# Altium schematic sheet BBB_Connection.SchDoc
size A3; Author: Sofian Jafar; Engineer: Sofian Jafar; DocumentNumber: 3; Revision: 1.0; SheetNumber: 3; SheetTotal: 3; Descripition: UltraSound BBB Cape; SheetDescription: Connectors and HV Power Supply
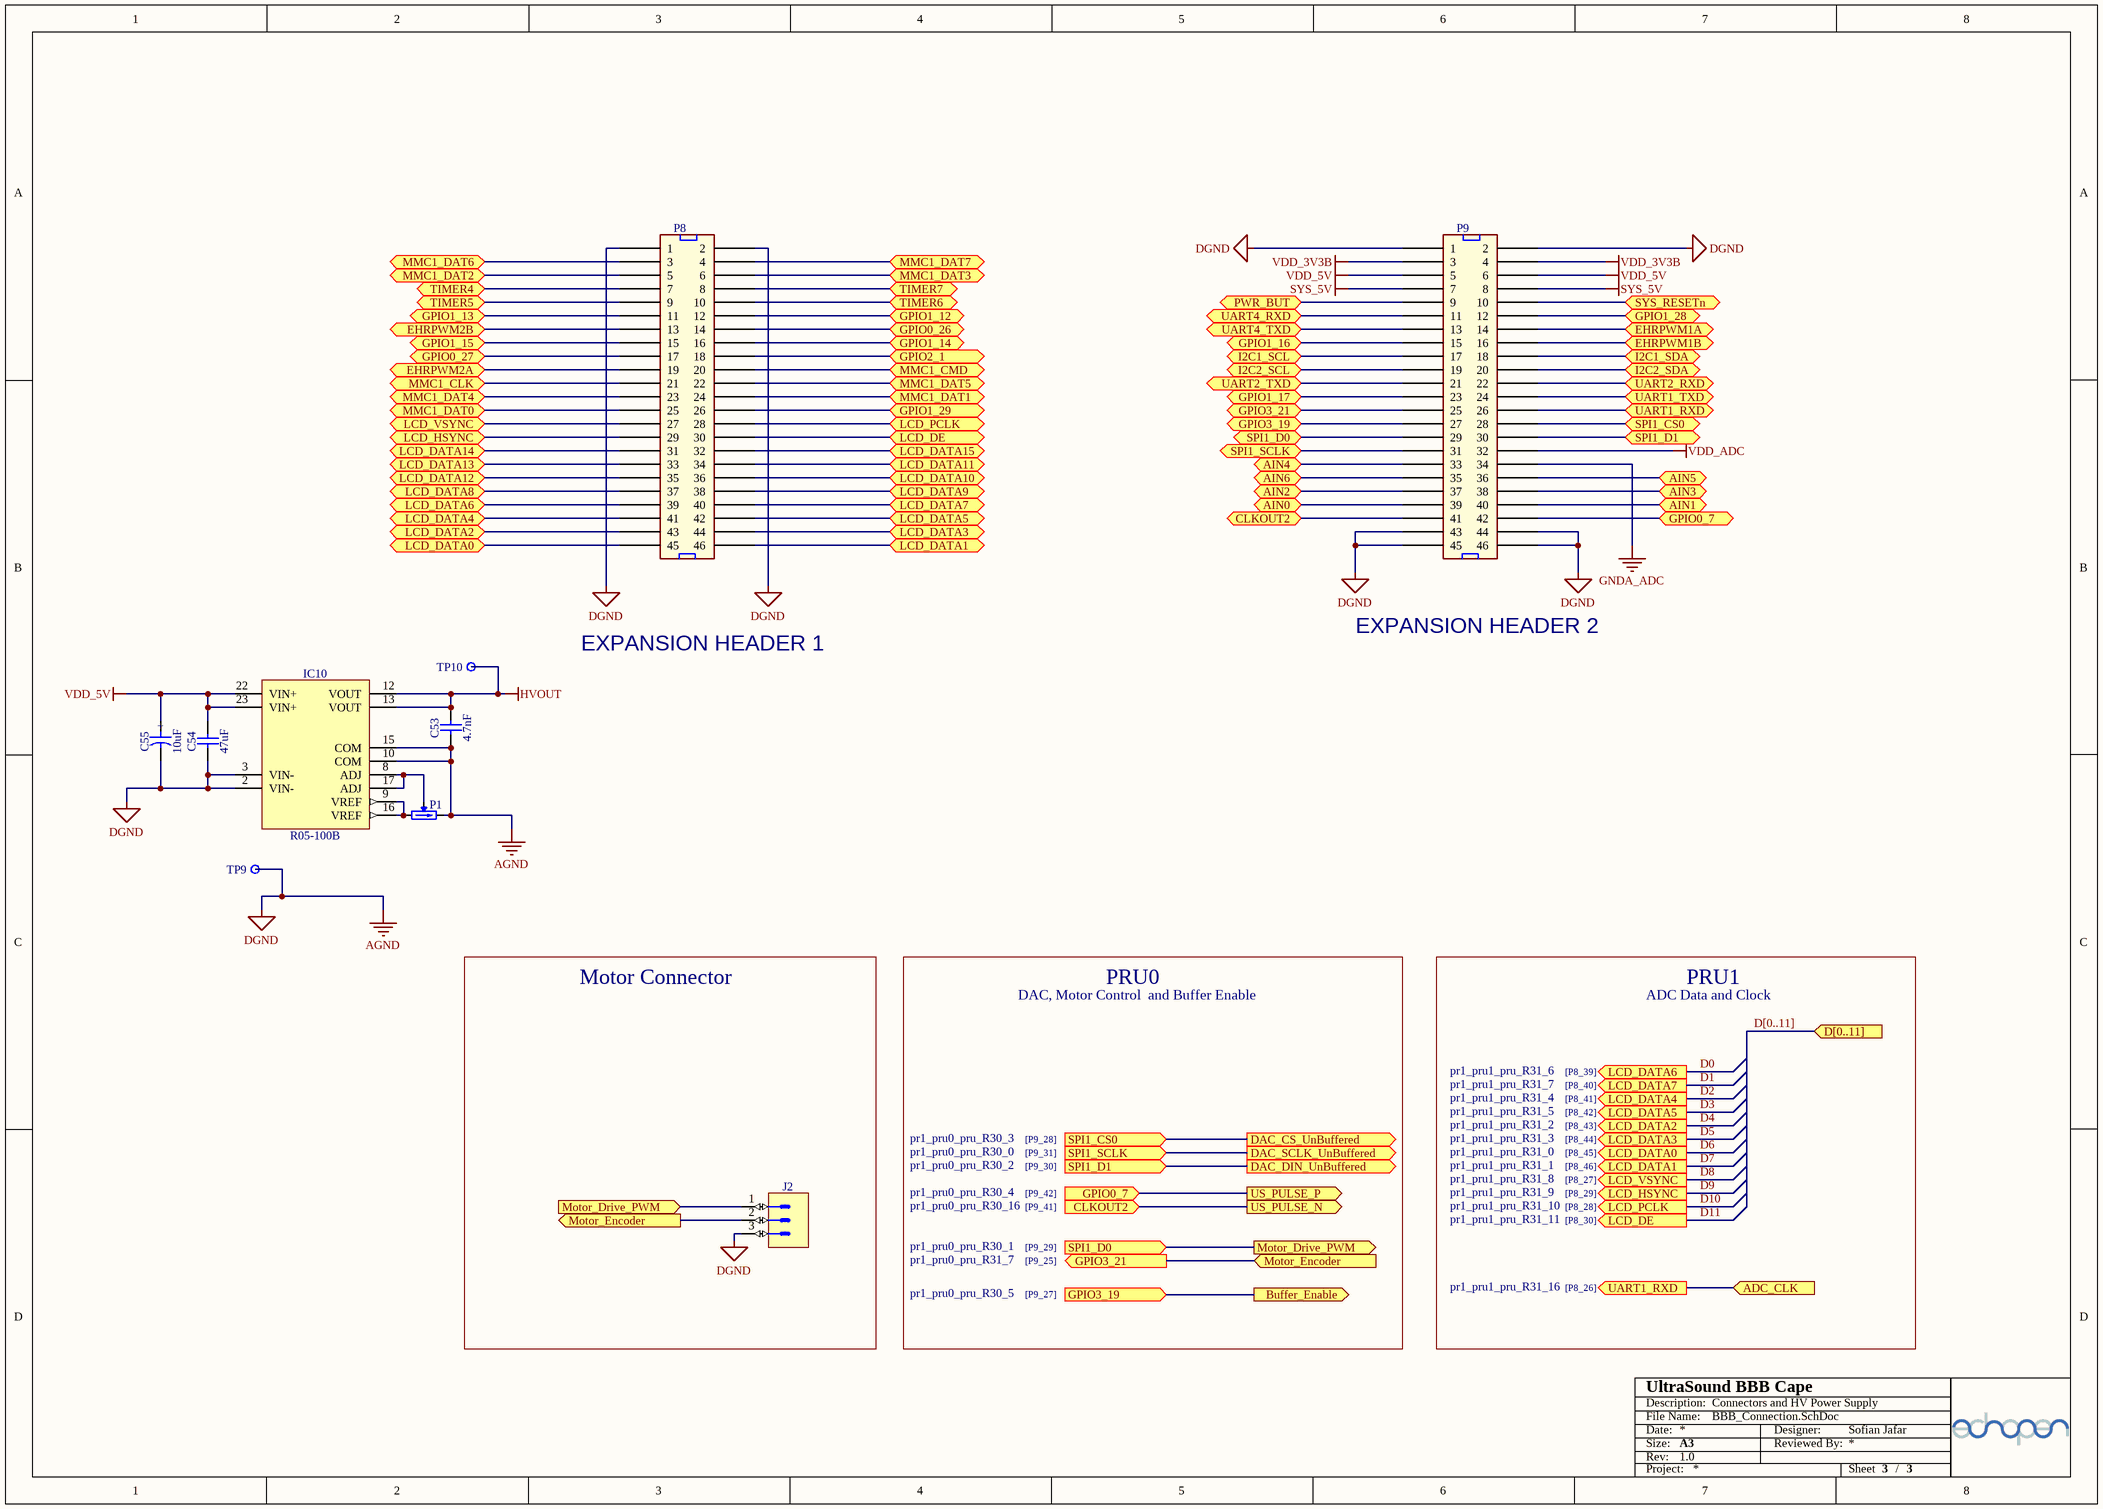
[diagram p0: BBB_Connection.SchDoc]

## Parts
C53  4.7nF  [CAPC2012X110N]
C54  47uF  [CAPC3216X180N]
C55  10uF  [CAPMP3528X210N]
IC10  R05-100B  [PWS_RECOM_R05-100B]
J2  (no value)  [PHOENIX_1803439]
P1  5k  [TRIM_BOURNS_3223W]  (value not drawn)
P8  (no value)  [SAMTEC_TSW-123-07-L-D-LL]
P9  (no value)  [SAMTEC_TSW-123-07-L-D-LL]
TP9  Test Point  [NICOMATIC_C12000B]  (value not drawn)
TP10  Test Point  [NICOMATIC_C12000B]  (value not drawn)

## Blocks framed on the sheet
Motor Connector: J2

## Ports
ADC_CLK (in), AIN0, AIN1, AIN2, AIN3, AIN4, AIN5, AIN6, Buffer_Enable (out), CLKOUT2, CLKOUT2 (in), D[0..11] (in), DAC_CS_UnBuffered (out), DAC_DIN_UnBuffered (out), DAC_SCLK_UnBuffered (out), EHRPWM1A, EHRPWM1B, EHRPWM2A, EHRPWM2B, GPIO0_7, GPIO0_7 (in), GPIO0_26, GPIO0_27, GPIO1_12, GPIO1_13, GPIO1_14, GPIO1_15, GPIO1_16, GPIO1_17, GPIO1_28, GPIO1_29, GPIO2_1, GPIO3_19, GPIO3_19 (in), GPIO3_21, GPIO3_21 (out), I2C1_SCL, I2C1_SDA, I2C2_SCL, I2C2_SDA, LCD_DATA0, LCD_DATA0 (out), LCD_DATA1, LCD_DATA1 (out), LCD_DATA2, LCD_DATA2 (out), LCD_DATA3, LCD_DATA3 (out), LCD_DATA4, LCD_DATA4 (out), LCD_DATA5, LCD_DATA5 (out), LCD_DATA6, LCD_DATA6 (out), LCD_DATA7, LCD_DATA7 (out), LCD_DATA8, LCD_DATA9, LCD_DATA10, LCD_DATA11, LCD_DATA12, LCD_DATA13, LCD_DATA14, LCD_DATA15, LCD_DE, LCD_DE (out), LCD_HSYNC, LCD_HSYNC (out), LCD_PCLK, LCD_PCLK (out), LCD_VSYNC, LCD_VSYNC (out), MMC1_CLK, MMC1_CMD, MMC1_DAT0, MMC1_DAT1, MMC1_DAT2, MMC1_DAT3, MMC1_DAT4, MMC1_DAT5, MMC1_DAT6, MMC1_DAT7, Motor_Drive_PWM (in), Motor_Drive_PWM (out), Motor_Encoder (in), Motor_Encoder (out), PWR_BUT, SPI1_CS0, SPI1_CS0 (in), SPI1_D0, SPI1_D0 (in), SPI1_D1, SPI1_D1 (in), SPI1_SCLK, SPI1_SCLK (in), SYS_RESETn, TIMER4, TIMER5, TIMER6, TIMER7, UART1_RXD, UART1_RXD (out), UART1_TXD, UART2_RXD, UART2_TXD, UART4_RXD, UART4_TXD, US_PULSE_N (out), US_PULSE_P (out)

## Nets
AGND: C53.1 C54.1 C55.2 IC10.2(VIN-) IC10.3(VIN-) IC10.10(COM) IC10.15(COM) J2.3 P1.3(CW) P8.1 P8.2 P9.1 P9.2 P9.43 P9.44 P9.45 P9.46 TP9.1  [also labelled DGND]
GNDA_ADC: P9.34
HVOUT: C53.2 IC10.12(VOUT) IC10.13(VOUT) TP10.1
SYS_5V: P9.7 P9.8
VDD_3V3B: P9.3 P9.4
VDD_5V: C54.2 C55.1 IC10.22(VIN+) IC10.23(VIN+) P9.5 P9.6
VDD_ADC: P9.32
ADC_CLK: P9.26 ; port UART1_RXD, port ADC_CLK
AIN0: P9.39 ; port AIN0
AIN1: P9.40 ; port AIN1
AIN2: P9.37 ; port AIN2
AIN3: P9.38 ; port AIN3
AIN4: P9.33 ; port AIN4
AIN5: P9.36 ; port AIN5
AIN6: P9.35 ; port AIN6
Buffer_Enable: P9.27 ; port GPIO3_19, port Buffer_Enable
CLKOUT2: P9.41 ; port CLKOUT2, port US_PULSE_N
D0: P8.39 ; port LCD_DATA6
D1: P8.40 ; port LCD_DATA7
D2: P8.41 ; port LCD_DATA4
D3: P8.42 ; port LCD_DATA5
D4: P8.43 ; port LCD_DATA2
D5: P8.44 ; port LCD_DATA3
D6: P8.45 ; port LCD_DATA0
D7: P8.46 ; port LCD_DATA1
D8: P8.27 ; port LCD_VSYNC
D9: P8.29 ; port LCD_HSYNC
D10: P8.28 ; port LCD_PCLK
D11: P8.30 ; port LCD_DE
DAC_CS_UnBuffered: P9.28 ; port SPI1_CS0, port DAC_CS_UnBuffered
DAC_DIN_UnBuffered: P9.30 ; port SPI1_D1, port DAC_DIN_UnBuffered
DAC_SCLK_UnBuffered: P9.31 ; port SPI1_SCLK, port DAC_SCLK_UnBuffered
EHRPWM1A: P9.14 ; port EHRPWM1A
EHRPWM1B: P9.16 ; port EHRPWM1B
EHRPWM2A: P8.19 ; port EHRPWM2A
EHRPWM2B: P8.13 ; port EHRPWM2B
GPIO0_7: P9.42 ; port GPIO0_7, port US_PULSE_P
GPIO0_26: P8.14 ; port GPIO0_26
GPIO0_27: P8.17 ; port GPIO0_27
GPIO1_12: P8.12 ; port GPIO1_12
GPIO1_13: P8.11 ; port GPIO1_13
GPIO1_14: P8.16 ; port GPIO1_14
GPIO1_15: P8.15 ; port GPIO1_15
GPIO1_16: P9.15 ; port GPIO1_16
GPIO1_17: P9.23 ; port GPIO1_17
GPIO1_28: P9.12 ; port GPIO1_28
GPIO1_29: P8.26 ; port GPIO1_29
GPIO2_1: P8.18 ; port GPIO2_1
GPIO3_21: J2.2 P9.25 ; port GPIO3_21, port Motor_Encoder
I2C1_SCL: P9.17 ; port I2C1_SCL
I2C1_SDA: P9.18 ; port I2C1_SDA
I2C2_SCL: P9.19 ; port I2C2_SCL
I2C2_SDA: P9.20 ; port I2C2_SDA
LCD_DATA8: P8.37 ; port LCD_DATA8
LCD_DATA9: P8.38 ; port LCD_DATA9
LCD_DATA10: P8.36 ; port LCD_DATA10
LCD_DATA11: P8.34 ; port LCD_DATA11
LCD_DATA12: P8.35 ; port LCD_DATA12
LCD_DATA13: P8.33 ; port LCD_DATA13
LCD_DATA14: P8.31 ; port LCD_DATA14
LCD_DATA15: P8.32 ; port LCD_DATA15
MMC1_CLK: P8.21 ; port MMC1_CLK
MMC1_CMD: P8.20 ; port MMC1_CMD
MMC1_DAT0: P8.25 ; port MMC1_DAT0
MMC1_DAT1: P8.24 ; port MMC1_DAT1
MMC1_DAT2: P8.5 ; port MMC1_DAT2
MMC1_DAT3: P8.6 ; port MMC1_DAT3
MMC1_DAT4: P8.23 ; port MMC1_DAT4
MMC1_DAT5: P8.22 ; port MMC1_DAT5
MMC1_DAT6: P8.3 ; port MMC1_DAT6
MMC1_DAT7: P8.4 ; port MMC1_DAT7
Motor_Drive_PWM: J2.1 P9.29 ; port SPI1_D0, port Motor_Drive_PWM
PWR_BUT: P9.9 ; port PWR_BUT
SYS_RESETn: P9.10 ; port SYS_RESETn
TIMER4: P8.7 ; port TIMER4
TIMER5: P8.9 ; port TIMER5
TIMER6: P8.10 ; port TIMER6
TIMER7: P8.8 ; port TIMER7
UART1_TXD: P9.24 ; port UART1_TXD
UART2_RXD: P9.22 ; port UART2_RXD
UART2_TXD: P9.21 ; port UART2_TXD
UART4_RXD: P9.11 ; port UART4_RXD
UART4_TXD: P9.13 ; port UART4_TXD
NetIC10_8: IC10.8(ADJ) IC10.17(ADJ) P1.2(W)
NetIC10_9: IC10.9(VREF) IC10.16(VREF) P1.1(CCW)

## Buses and harness runs
bus D[0..11] = port D[0..11]

## Notes on the sheet
- EXPANSION HEADER 1
- EXPANSION HEADER 2
- PRU0
- PRU1
- DAC, Motor Control  and Buffer Enable
- ADC Data and Clock
- pr1_pru1_pru_R31_2
- pr1_pru1_pru_R31_4
- pr1_pru1_pru_R31_5
- pr1_pru1_pru_R31_6
- pr1_pru1_pru_R31_7
- [P8_39]
- [P8_40]
- [P8_43]
- [P8_41]
- [P8_42]
- pr1_pru0_pru_R30_3
- pr1_pru0_pru_R30_0
- pr1_pru0_pru_R30_2
- [P9_28]
- [P9_31]
- [P9_30]
- pr1_pru1_pru_R31_0
- pr1_pru1_pru_R31_1
- pr1_pru1_pru_R31_3
- pr1_pru1_pru_R31_8
- [P8_27]
- [P8_45]
- [P8_46]
- [P8_44]
- pr1_pru0_pru_R30_1
- pr1_pru0_pru_R31_7
- pr1_pru0_pru_R30_16
- pr1_pru0_pru_R30_4
- [P9_29]
- [P9_25]
- [P9_41]
- [P9_42]
- pr1_pru1_pru_R31_9
- pr1_pru1_pru_R31_10
- pr1_pru1_pru_R31_11
- [P8_28]
- [P8_29]
- [P8_30]
- pr1_pru0_pru_R30_5
- [P9_27]
- pr1_pru1_pru_R31_16
- [P8_26]
- File Name:
- Date:
- Rev:
- Description:
- Size:
- A3
- Designer:
- Reviewed By:
- Project:
- Sheet
- /
- (in symbol CTE3528-21_10UF_16V_10%_LESR0800) +

## Library data of the parts
C53 = CC0805_4.7NF_250V_10%_X7R: Non-polarised capacitor; Part Description: SMD Multilayer Chip Ceramic Capacitor; Manufacturer: GENERIC; Manufacturer1 Part Number: GRM21AR72E472KW01D; Voltage: 250V; TC: X7R; Tolerance: ±10%; Table: Capacitors SMD; Part Number: CC0805_4.7NF_250V_10%_X7R; Component Kind: Standard; Component Type: Standard; Pin Count: 2; Value: 4.7nF; Status: Preferred; Manufacturer Part Number: CC0805_4.7NF_250V_10%_X7R; Case: 0805; Mounted: Yes; Socket: No; SMD: Yes; Manufacturer1 Example: MURATE; Manufacturer1 ComponentHeight: 1.1mm; Author: S. Jafar; CreateDate: 12/21/2015; LatestRevisionDate: 1/10/2016
C54 = CC1206_47UF_25V_20%_X5R: Non-polarised capacitor; Part Description: SMD Multilayer Chip Ceramic Capacitor; Manufacturer: TDK; Manufacturer Part Number: C3216X5R1E476M160AC; Voltage: 25V; TC: X5R; Tolerance: ±20%; Table: Capacitors SMD; Part Number: CC1206_47UF_25V_20%_X5R; Component Kind: Standard; Component Type: Standard; Pin Count: 2; Value: 47uF; Status: None; Case: 1206; Mounted: Yes; Socket: No; SMD: Yes; ComponentHeight: 1.8mm; HelpURL: \\cern.ch\dfs\Applications\Altium\Datasheets\CC1206_X5R_TDK_C.pdf; Author: CERN DEM JLC; CreateDate: 11/20/2013; LatestRevisionDate: 11/20/2013
C55 = CTE3528-21_10UF_16V_10%_LESR0800: Polarised capacitor; Part Description: Low ESR 0R8 Solid Tantalum Chip Capacitor; Manufacturer: GENERIC; Manufacturer1 Part Number: TPSB106K016R0800; Voltage: 16V; Tolerance: ±10%; Table: Capacitors SMD; Part Number: CTE3528-21_10UF_16V_10%_LESR0800; Component Kind: Standard; Component Type: Standard; Pin Count: 2; Value: 10uF; Status: Preferred; Manufacturer Part Number: CTE3528-21_10UF_16V_10%_LESR0800; Case: B; Mounted: Yes; Socket: No; SMD: Yes; Manufacturer1 Example: AVX; Manufacturer1 ComponentHeight: 2.1mm; HelpURL: \\cern.ch\dfs\Applications\Altium\Datasheets\CTE-LESR_AVX_TPS.pdf; Author: CERN DEM JLC; CreateDate: 5/5/2008; LatestRevisionDate: 1/20/2009
IC10 = R05-100B: Power Supply; Part Description: +5VDC to +55-135VDC 5W Power Supply; Manufacturer: RECOM POWER; Table: Power Supplies; Part Number: R05-100B; Component Kind: Standard; Component Type: Standard; Device: R05-100B; PackageDescription: 55-135V 5W Power Supply, Body 32x21mm; Status: None; Manufacturer Part Number: R05-100B; Pin Count: 12; Mounted: Yes; Socket: No; SMD: No; ComponentHeight: 9.4mm; Author: S. Jafar; CreateDate: 12/21/2015; LatestRevisionDate: 12/21/2015
J2 = PHOENIX_1803439: Connector 3 Male; Part Description: 8A 160 V, Pitch: 3.81mm, 3 Positions Header; Manufacturer: PHOENIX CONTACT; Manufacturer Part Number: 1803439 (MCV 1,5/3-G-3,81); Part Number: PHOENIX_1803439; Component Kind: Standard; Component Type: Standard; Pin Count: 3; Mounted: Yes; Socket: No; SMD: No; Status: None; ComponentHeight: 9.2mm; HelpURL: \\cern.ch\dfs\Applications\Altium\Datasheets\PHOENIX_1803439.pdf; Author: CERN DEM JLC; CreateDate: 5/4/2010; LatestRevisionDate: 5/4/2010; Table: PHOENIX
P1 = TRIM_11T_5K_BOURNS_3223W-1-502E: Trimming Potentiometer; Part Description: 11 Turns SMD Trimpot® Trimming Potentiometer (Top Adjust); Manufacturer: BOURNS; Power: 0.125W; TC: ±100ppm/°C; Tolerance: ±20%; Table: Potentiometers SMD; Part Number: TRIM_11T_5K_BOURNS_3223W-1-502E; Component Kind: Standard; Component Type: Standard; Pin Count: 3; Value: 5k; Manufacturer Part Number: 3223W-1-502E; Case: 3223W; Mounted: Yes; Socket: No; SMD: Yes; ComponentHeight: 4.16mm; HelpURL: \\cern.ch\dfs\Applications\Altium\Datasheets\TRIM_BOURNS_3223W.pdf; Author: CERN DEM JLC; CreateDate: 3/31/2011; LatestRevisionDate: 12/18/2012
P8 P9 = SAMTEC_TSW-123-07-L-D-LL_a: Connector 46 Male; Part Description: 46 Contacts - Pitch 2.54mm - Dual Row Through Mount  Straigh Header With Locking Lead (Lead Length 2.54mm); Manufacturer: SAMTEC; Part Number: SAMTEC_TSW-123-07-L-D-LL_a; Component Kind: Standard; Component Type: Standard; Pin Count: 46; Family: Header 46; Mounted: Yes; Socket: No; SMD: No; Status: None; Manufacturer Part Number: TSW-123-07-L-D-LL; ComponentHeight: 8.38mm; HelpURL: \\cern.ch\dfs\Applications\Altium\Datasheets\SAMTEC_TSW-123-07-L-D-LL.pdf; Author: S. Jafar; CreateDate: 12/26/2015; LatestRevisionDate: 12/26/2015; Table: SAMTEC
TP9 TP10 = NICOMATIC_C12000B: Part Description: SMD Test Point; Table: Miscellaneous; Part Number: NICOMATIC_C12000B; Component Kind: Standard; Component Type: Standard; Pin Count: 1; Family: Test Point; Mounted: Yes; Socket: No; SMD: Yes; Status: None; Manufacturer: NICOMATIC; Manufacturer Part Number: C12000B; ComponentHeight: 1.5mm; HelpURL: \\cern.ch\dfs\Applications\Altium\Datasheets\NICOMATIC_C12000B.pdf; Author: CERN DEM JLC; CreateDate: 3/25/2009; LatestRevisionDate: 3/25/2009